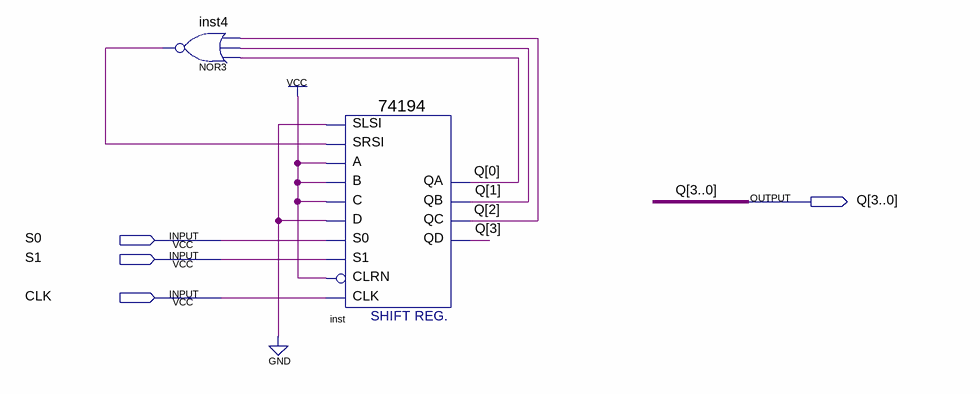
[diagram p0: schematic sheet]
// Quartus schematic lab3.bdf as structural Verilog: 2 symbols, 4 pins
module lab3 (
  input  S0,
  input  S1,
  input  CLK,
  output [3:0] Q
);

  wire inst4_out;

  nor inst4 (inst4_out, Q[0], Q[1], Q[2]);
  \74194  inst (
    .SLSI(1'b0), .SRSI(inst4_out), .B(1'b1), .C(1'b1), .CLK(CLK), .CLRN(1'b1), .D(1'b0), .S1(S1), .S0(S0),
    .A(1'b1), .QA(Q[0]), .QB(Q[1]), .QC(Q[2]), .QD(Q[3]));
endmodule
